# Altium schematic sheet HSS.SchDoc
size A4; SheetNumber: 10; SheetTotal: 13
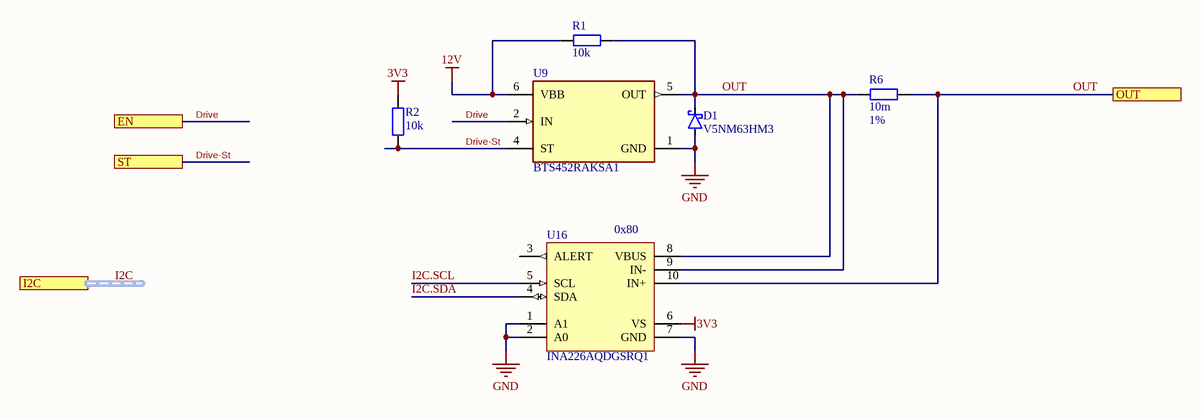
[diagram p0: HSS.SchDoc]

## Parts
D1  V5NM63HM3  [DFN3820A]
R1  value 10k  [SMD_0603_RES]  (hidden comment: ERJ-3EKF1002V)
R2  value 10k  [SMD_0603_RES]  (hidden comment: ERJ-3EKF1002V)
R6  value 10m  Tolerance: 1%  [SMD_1206_RES]  (hidden comment: ERJ-8BWFR010V)
U9  BTS452RAKSA1  [FP-PG-TO252-5-MFG]
U16  INA226AQDGSRQ1  [TI-DGS0010A-VSSOP-10]

## Ports
EN, I2C (harness I2C), OUT, ST

## Nets
3V3: R2.2 U16.6(VS)
12V: R1.1 U9.6(VBB)
GND: D1.2(A) U9.1(GND) U16.1(A1) U16.2(A0) U16.7(GND)
Drive: U9.2(IN) ; port EN
Drive-St: R2.1 U9.4(ST) ; port ST
I2C.SCL: U16.5(SCL)
I2C.SDA: U16.4(SDA)
OUT: D1.1(C) R1.2 R6.1 R6.2 U9.5(OUT) U16.8(VBUS) U16.9(IN-) U16.10(IN+) ; port OUT

Not connected (* = marked no-connect by the designer): U16 3(ALERT)

## Buses and harness runs
harness I2C = port I2C

## Notes on the sheet
- (near U16) 0x80

## Library data of the parts
D1 = CMP-004-00025-A01: Vishay - 5A, 60V Schottky diode, DFN3820A, DO-220AA compatible; Forward Voltage: 430mV; RoHS Compliant: Yes; Pins: 2; Operating Temperature (Max): 175°C; Mounting Technology: SMD; Operating Temperature (Min): -40°C; Peak Reverse Voltage: 60V; Case/Package: DFN3820A; Forward Current: 5A
R1 R2 = CMP-009-07799-A10: RES SMD 10K OHM 1% 1/10W 0603 ±100ppm/°C; Voltage Rating: 75V; Power: 100mW; Tolerance: 1%; Pins: 2; RoHS Compliant: Yes; Temperature Coefficient: ±100ppm/°C; Operating Temperature (Min): -55°C; Mounting Technology: SMT; Case/Package: 0603; Operating Temperature (Max): 125°C
R6 = CMP-009-10450-A07: RES SMD 0.01 OHM 1% 1 1206 ±200ppm/°C; Power: 1W; Voltage Rating: 200V; Operating Temperature (Max): 125°C; Temperature Coefficient: ±200ppm/°C; Case/Package: 1206; Pins: 2; Mounting Technology: SMT; Operating Temperature (Min): -55°C; RoHS Compliant: Yes
U9 = CMP-00196-84309267-1: BTS452RAKSA1 Power Load Sw, High Side, -40 To 150Degc Rohs Compliant: Yes; Nominal Supply Current: 800µA; Min Supply Voltage: 6V; Number of Outputs: 1; Output Current: 1.8A; Max Supply Voltage: 52V; Max Power Dissipation: 41.6W; Max Junction Temperature (Tj): 150°C; NexarPartId: 84309267; Max Operating Temperature: 150°C; Min Operating Temperature: -40°C; Height: 2.5mm
U16 = CMP-015-00037-A01: SP Amp Current Shunt and Power Monitor Dual 5.5V 10-Pin VSSOP T/R; Interface: I2C; Samples Frequency: 500kHz; Sample Resolution: 16; Supply Voltage (Min): 2.7V; Signal Type: Differential; Operating Temperature (Min): -40°C; Case/Package: VSSOP; Pins: 10; Supply Voltage (Max): 5.5V; Operating Temperature (Max): 125°C; RoHS Compliant: Yes; Mounting Technology: Surface Mount